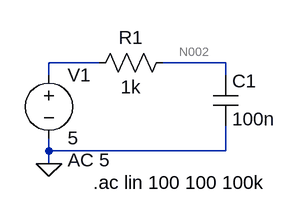
[diagram p0: schematic Aufgabe3a.asc]
Aufgabe3a.asc, the LTspice schematic file:
Version 4
SHEET 1 880 680
WIRE 112 80 48 80
WIRE 272 80 192 80
WIRE 48 96 48 80
WIRE 272 96 272 80
WIRE 48 192 48 176
WIRE 272 192 272 160
WIRE 272 192 48 192
WIRE 48 208 48 192
FLAG 48 208 0
SYMBOL res 208 64 R90
WINDOW 0 0 56 VBottom 2
WINDOW 3 32 56 VTop 2
SYMATTR InstName R1
SYMATTR Value 1k
SYMBOL cap 256 96 R0
SYMATTR InstName C1
SYMATTR Value 100n
SYMBOL voltage 48 80 R0
WINDOW 123 24 124 Left 2
WINDOW 39 24 124 Left 2
SYMATTR Value2 AC 5
SYMATTR InstName V1
SYMATTR Value 5
TEXT 104 232 Left 2 !.ac lin 100 100 100k

The netlist it stands for:
* Aufgabe3a.asc
R1 N002 N001 1k
C1 N002 0 100n
V1 N001 0 5 AC 5
.ac lin 100 100 100k
.backanno
.end

* Results of the author's LTspice run, read from the files saved beside the schematic
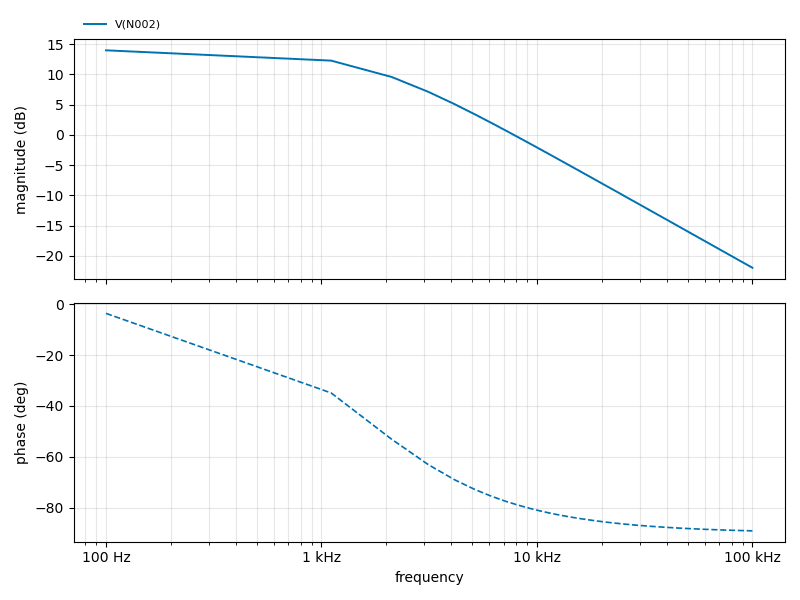
[diagram p1: AC Analysis of Aufgabe3a.asc, plotted from the saved traces]
* AC Analysis, 1 run:
*   V(N002): 13.96 dB at 100 Hz, -21.99 dB at 100 kHz, peak 13.96 dB at 100 Hz, 3 dB below the peak at 1.516 kHz